# Altium schematic sheet AT89xx Programmer.SchDoc: AT89xx Programmer
size A4; Author: Tran Tuan; CompanyName: Vnelektronics Co.,Ltd; DrawnBy: Tran Tuan; Engineer: Tran Tuan; Organization: Vnelektronics Co.,Ltd; Address1: 776 Ton Duc Thang; Address2: Lien Chieu, Da Nang; Revision: 1.1; SheetNumber: 01; SheetTotal: 01; ProjectName: AT89xx Programmer
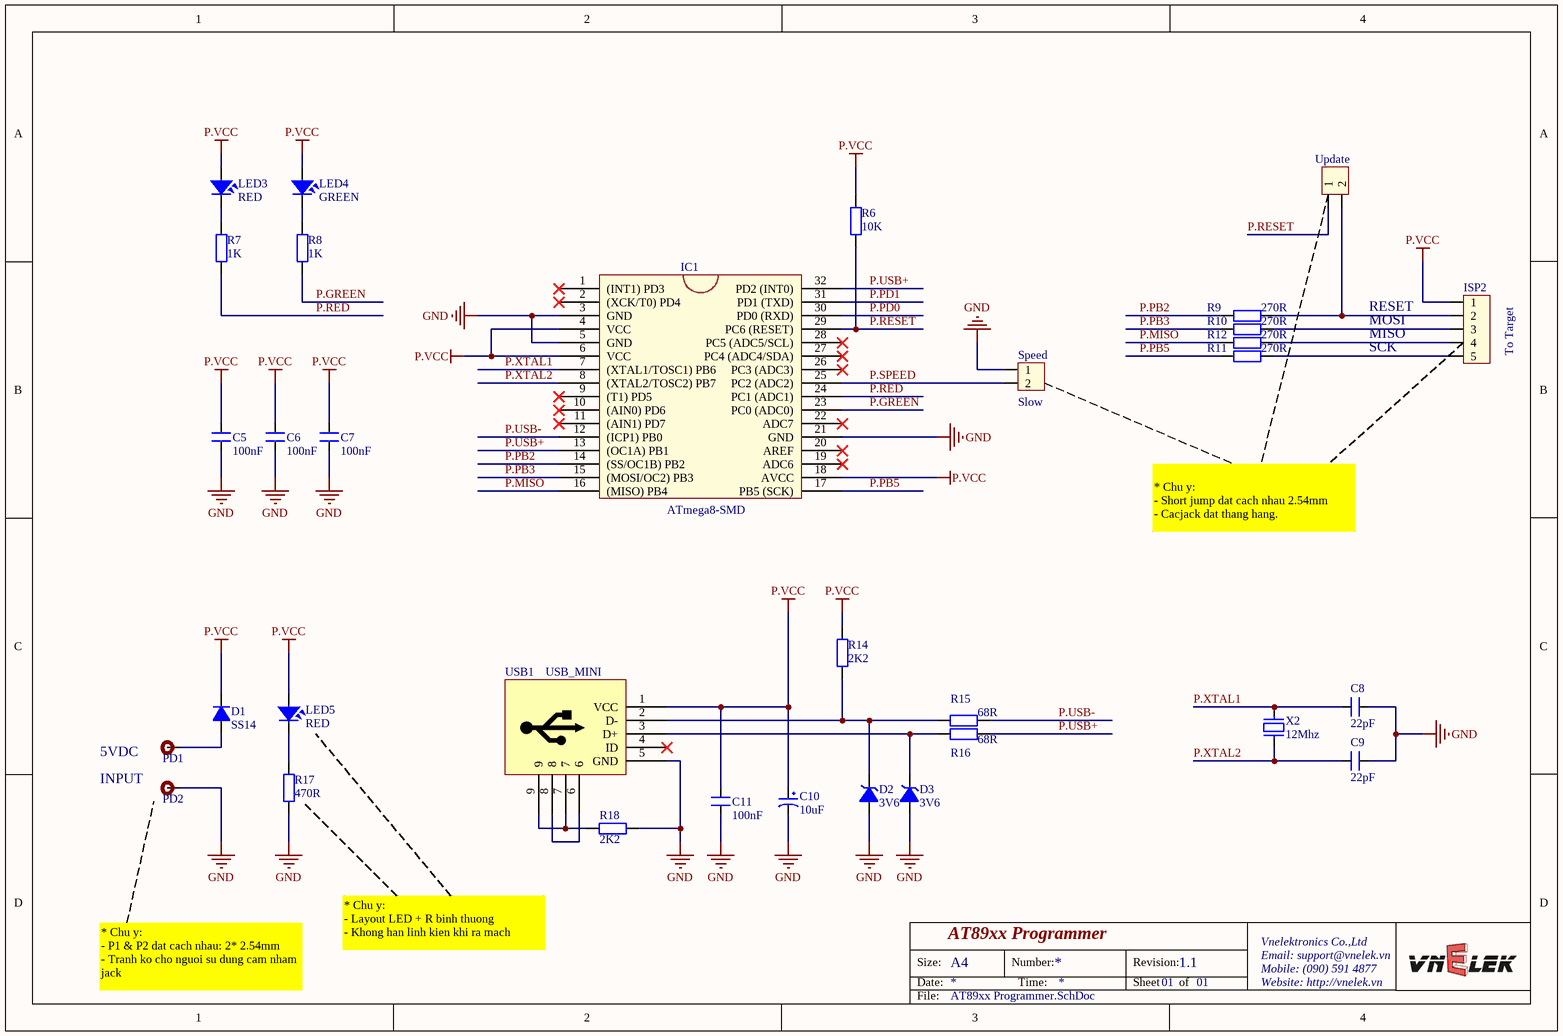
[diagram p0: AT89xx Programmer.SchDoc]

## Parts
C5  100nF  [C0805]
C6  100nF  [C0805]
C7  100nF  [C0805]
C8  22pF  [C0603]
C9  22pF  [C0603]
C10  10uF  [C1210]
C11  100nF  [C0805]
D1  SS14  [SS14]
D2  3V6  [1N5223]
D3  3V6  [1N5223]
IC1  ATmega8-SMD  [ATMEGA_8_SMD]
ISP2  To Target  [Header_5]
LED3  RED  [Led 0805R]
LED4  GREEN  [Led 0805G]
LED5  RED  [Led 0805R]
PD1  Pad Big  (value not drawn)
PD2  Pad Big  (value not drawn)
R6  value 10K  [RESC2012(0805)]  (hidden comment: Res2)
R7  value 1K  [RESC2012(0805)]  (hidden comment: Res2)
R8  value 1K  [RESC2012(0805)]  (hidden comment: Res2)
R9  value 270R  [RESC2012(0805)]  (hidden comment: Res2)
R10  value 270R  [RESC2012(0805)]  (hidden comment: Res2)
R11  value 270R  [RESC2012(0805)]  (hidden comment: Res2)
R12  value 270R  [RESC2012(0805)]  (hidden comment: Res2)
R14  value 2K2  [RESC2012(0805)]  (hidden comment: Res2)
R15  value 68R  [RESC2012(0805)]  (hidden comment: Res2)
R16  value 68R  [RESC2012(0805)]  (hidden comment: Res2)
R17  value 470R  [RESC2012(0805)]  (hidden comment: Res2)
R18  value 2K2  [RESC2012(0805)]  (hidden comment: Res2)
Speed  Slow  [Header_2]
Update  Update  [Header_2]  (value not drawn)
USB1  USB_MINI  [USBMNIB]
X2  12Mhz  [CRYSTAL]

## Nets
GND: C5.1 C6.1 C7.1 C8.1 C9.1 C10.2 C11.1 D2.1(A) D3.1(A) IC1.3(GND) IC1.5(GND) IC1.21(GND) PD2.1 R17.2 R18.2 Speed.1 USB1.5(GND)
P.VCC: C5.2 C6.2 C7.2 C10.1 C11.2 D1.2(K) IC1.4(VCC) IC1.6(VCC) IC1.18(AVCC) ISP2.1 LED3.1 LED4.1 LED5.1 R6.2 R14.1 USB1.1(VCC)
P.GREEN: IC1.23(PC0_(ADC0)) R8.2
P.MISO: IC1.16((MISO)_PB4) R12.1
P.PB2: IC1.14((SS/OC1B)_PB2) R9.1
P.PB3: IC1.15((MOSI/OC2)_PB3) R10.1
P.PB5: IC1.17(PB5_(SCK)) R11.1
P.PD0: IC1.30(PD0_(RXD))
P.PD1: IC1.31(PD1_(TXD))
P.RED: IC1.24(PC1_(ADC1)) R7.2
P.RESET: IC1.29(PC6_(RESET)) R6.1 Update.1
P.SPEED: IC1.25(PC2_(ADC2)) Speed.2
P.USB+: IC1.13((OC1A)_PB1) IC1.32(PD2_(INT0)) R16.1
P.USB-: IC1.12((ICP1)_PB0) R15.1
P.XTAL1: C8.2 IC1.7((XTAL1/TOSC1)_PB6) X2.1
P.XTAL2: C9.2 IC1.8((XTAL2/TOSC2)_PB7) X2.2
NetD1_1: D1.1(A) PD1.1
NetD2_2: D2.2(K) R14.2 R15.2 USB1.2(D-)
NetD3_2: D3.2(K) R16.2 USB1.3(D+)
NetISP2_2: ISP2.2 R9.2 Update.2
NetISP2_3: ISP2.3 R10.2
NetISP2_4: ISP2.4 R12.2
NetISP2_5: ISP2.5 R11.2
NetLED3_2: LED3.2 R7.1
NetLED4_2: LED4.2 R8.1
NetLED5_2: LED5.2 R17.1
NetR18_1: R18.1 USB1.7 USB1.9
NetUSB1_6: USB1.6 USB1.8

Not connected (* = marked no-connect by the designer): IC1 1((INT1)_PD3)* 2((XCK/T0)_PD4)* 9((T1)_PD5)* 10((AIN0)_PD6)* 11((AIN1)_PD7)* 19(ADC6)* 20(AREF)* 22(ADC7)* 26(PC3_(ADC3))* 27(PC4_(ADC4/SDA))* 28(PC5_(ADC5/SCL))*; USB1 4(ID)*

## Notes on the sheet
- RESET
- MOSI
- MISO
- SCK
- * Chu y:
  - Short jump dat cach nhau 2.54mm
  - Cacjack dat thang hang.
- 5VDC
- INPUT
- * Chu y:
  - P1 & P2 dat cach nhau: 2* 2.54mm
  - Tranh ko cho nguoi su dung cam nham jack
- * Chu y:
  - Layout LED + R binh thuong
  - Khong han linh kien khi ra mach
- Size:
- Date:
- A4
- Number:
- Time:
- Revision:
- Sheet
- of
- Vnelektronics Co.,Ltd
- Mobile: (090) 591 4877
- Email: support@vnelek.vn
- Website: http://vnelek.vn
- File:

## Library data of the parts
C5-C7 C11 = CN2: Cap np 104 => 105pF; Value: 0.1uF
C8 C9 = CN1: Cap np  1pF - 472pF; Value: 100pF
C10 = CP1: Cap P  0,1uF < 22uF , 16 - 50V; Value: 10uF/50V; Description 1: 10 => 220uF/6,3V/10V - 10uF => 100uF/16V; Description 2: 0,1uF => 33uF/50V - 10uF => 22uF/63V; Description 3: 0,47uF => 10uF/100V
D1 = D1A: Diode 1A; Value: 1N4007
D2 D3 = DZ: Diode Zenner; Value: 3v3
IC1 = ATmega8_SMD_32pin: High-performance, Low-power Atmel  ®  AVR  ®   8-bit Microcontroller
ISP2 = Hed5: Header 5 (Green); Value: Header 5
LED3-LED5 = LED: LED Single colour Green and Red; Value: LED 3 ly Single Colour
PD1 PD2 = Pad_Big: Value: Pad Big - Hole
R6-R12 R14-R18 = Res2: Resistor; Published: 8-Jun-2000; LatestRevisionDate: 17-Jul-2002; LatestRevisionNote: Re-released for DXP Platform.; PackageReference: AXIAL-0.4; Publisher: Altium Limited; PackageDescription: Axial Device, Thru-Hole; 2 Leads; 0.4 in Pin Spacing
Speed Update = Hed2: Header 2 (Green); Value: Header 2
X2 = XT2: Crystal For all Crystal 2pin.; Value: 4Mhz